# EAGLE schematic ro (EAGLE 6.1)

## Sheet 1 of 4: MC Microcontroller
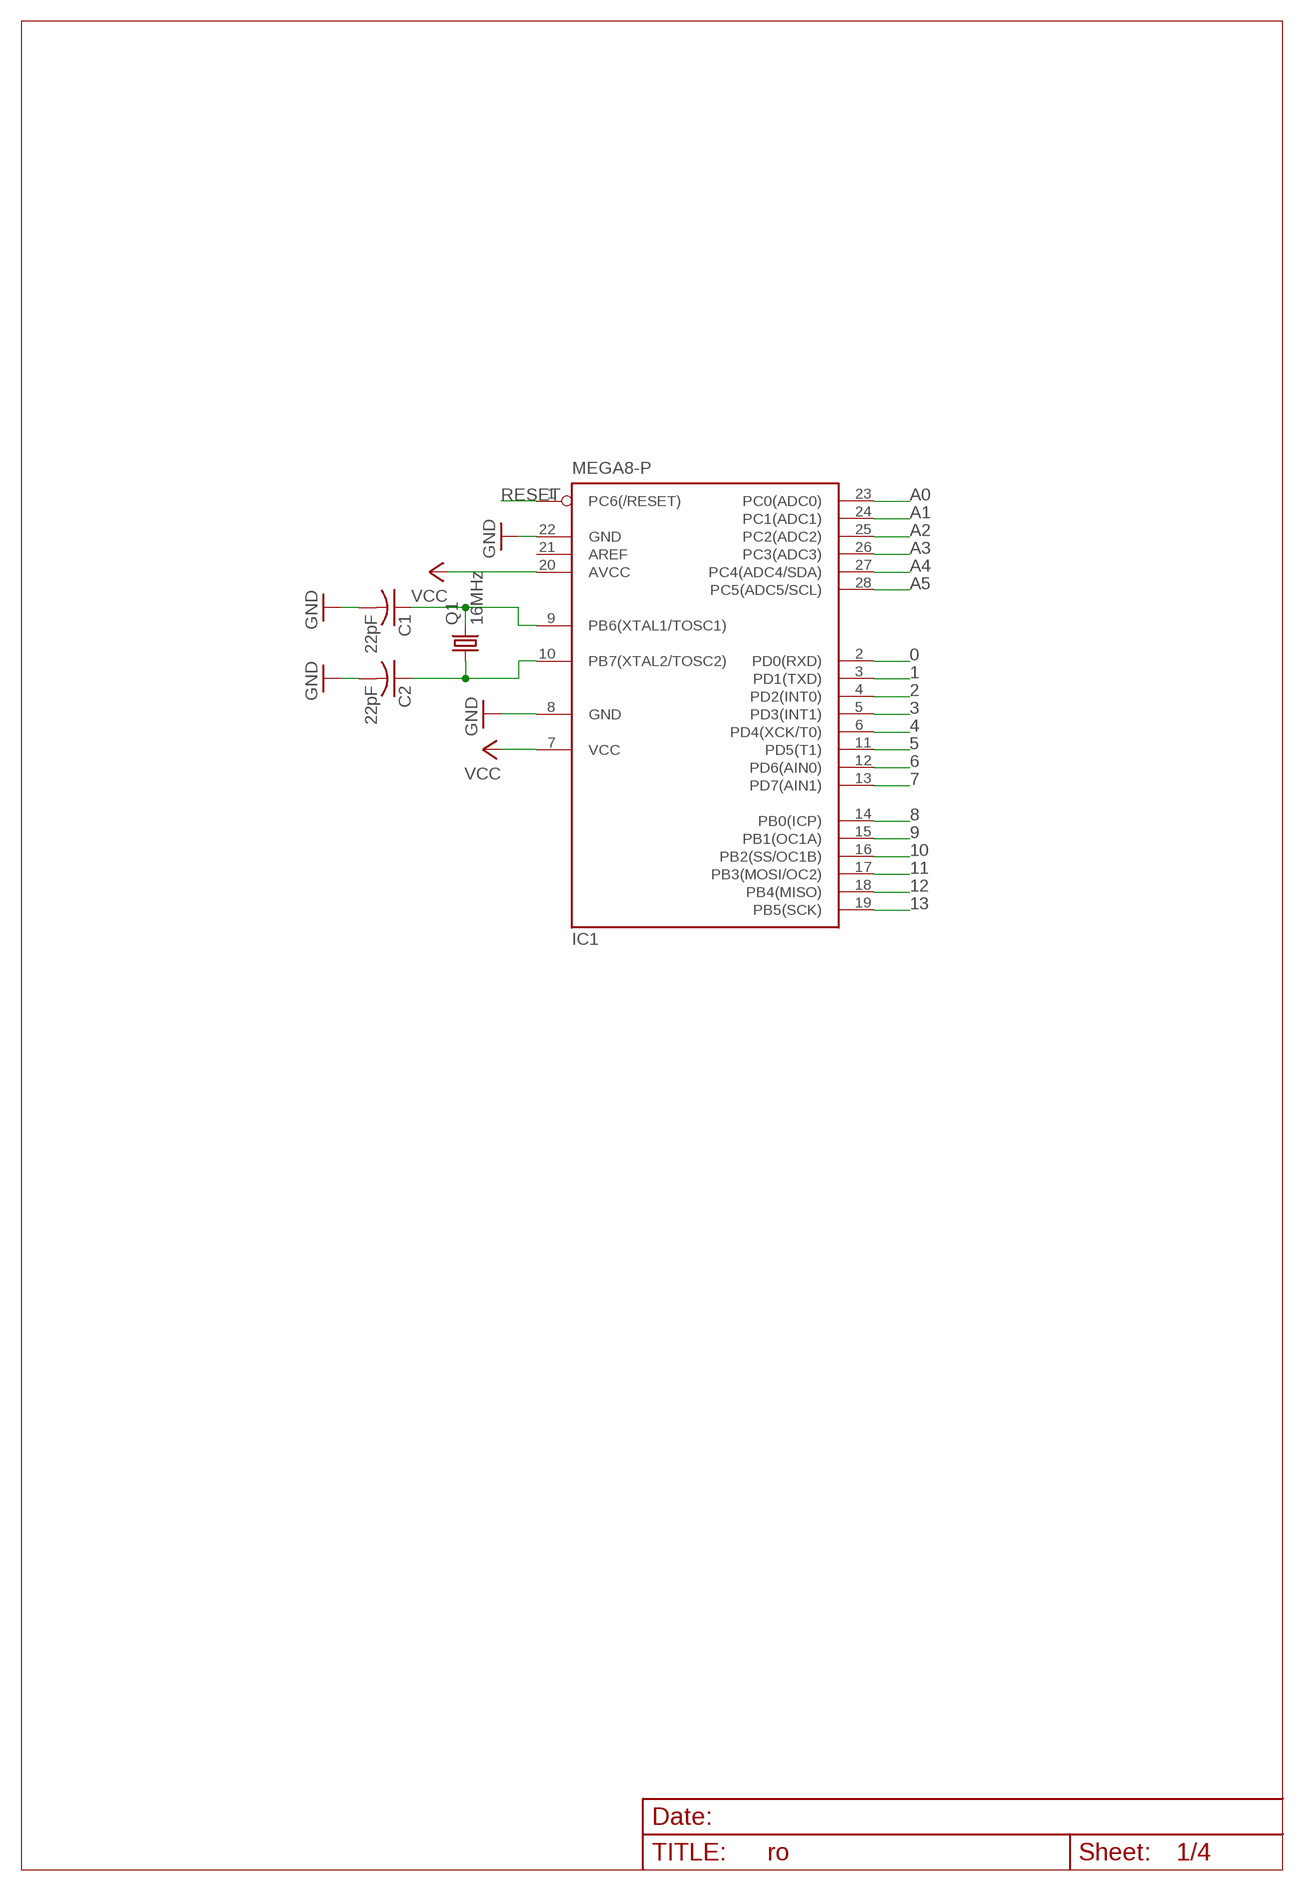
[diagram p0: schematic, sheet 1]

### Parts
C1  22pF  C-US025-025X050  [C025-025X050]
C2  22pF  C-US025-025X050  [C025-025X050]
IC1  MEGA8-P  [DIL28-3]
Q1  16MHz  CRYSTALHC49S  [HC49/S]

### Nets
0: IC1.2(PD0(RXD))
1: IC1.3(PD1(TXD))
2: IC1.4(PD2(INT0)) ; also sheet 3
3: IC1.5(PD3(INT1)) ; also sheet 3
4: IC1.6(PD4(XCK/T0))
5: IC1.11(PD5(T1))
6: IC1.12(PD6(AIN0))
7: IC1.13(PD7(AIN1)) ; also sheet 4
8: IC1.14(PB0(ICP)) ; also sheet 4
9: IC1.15(PB1(OC1A)) ; also sheet 4
10: IC1.16(PB2(SS/OC1B)) ; also sheet 4
11: IC1.17(PB3(MOSI/OC2)) ; also sheet 4
12: IC1.18(PB4(MISO)) ; also sheet 4
13: IC1.19(PB5(SCK))
A0: IC1.23(PC0(ADC0))
A1: IC1.24(PC1(ADC1))
A2: IC1.25(PC2(ADC2))
A3: IC1.26(PC3(ADC3)) ; also sheet 2
A4: IC1.27(PC4(ADC4/SDA)) ; also sheet 2
A5: IC1.28(PC5(ADC5/SCL)) ; also sheet 2
GND: C1.2 C2.2 IC1.8(GND) IC1.22(GND) ; also sheet 2,3,4
N$1: C1.1 IC1.9(PB6(XTAL1/TOSC1)) Q1.2
N$2: C2.1 IC1.10(PB7(XTAL2/TOSC2)) Q1.1
RESET: IC1.1(PC6(/RESET)) ; also sheet 3
VCC: IC1.7(VCC) IC1.20(AVCC) ; also sheet 2,3,4
Unconnected: IC1.21(AREF)

## Sheet 2 of 4: MAX6675 Thermocouple
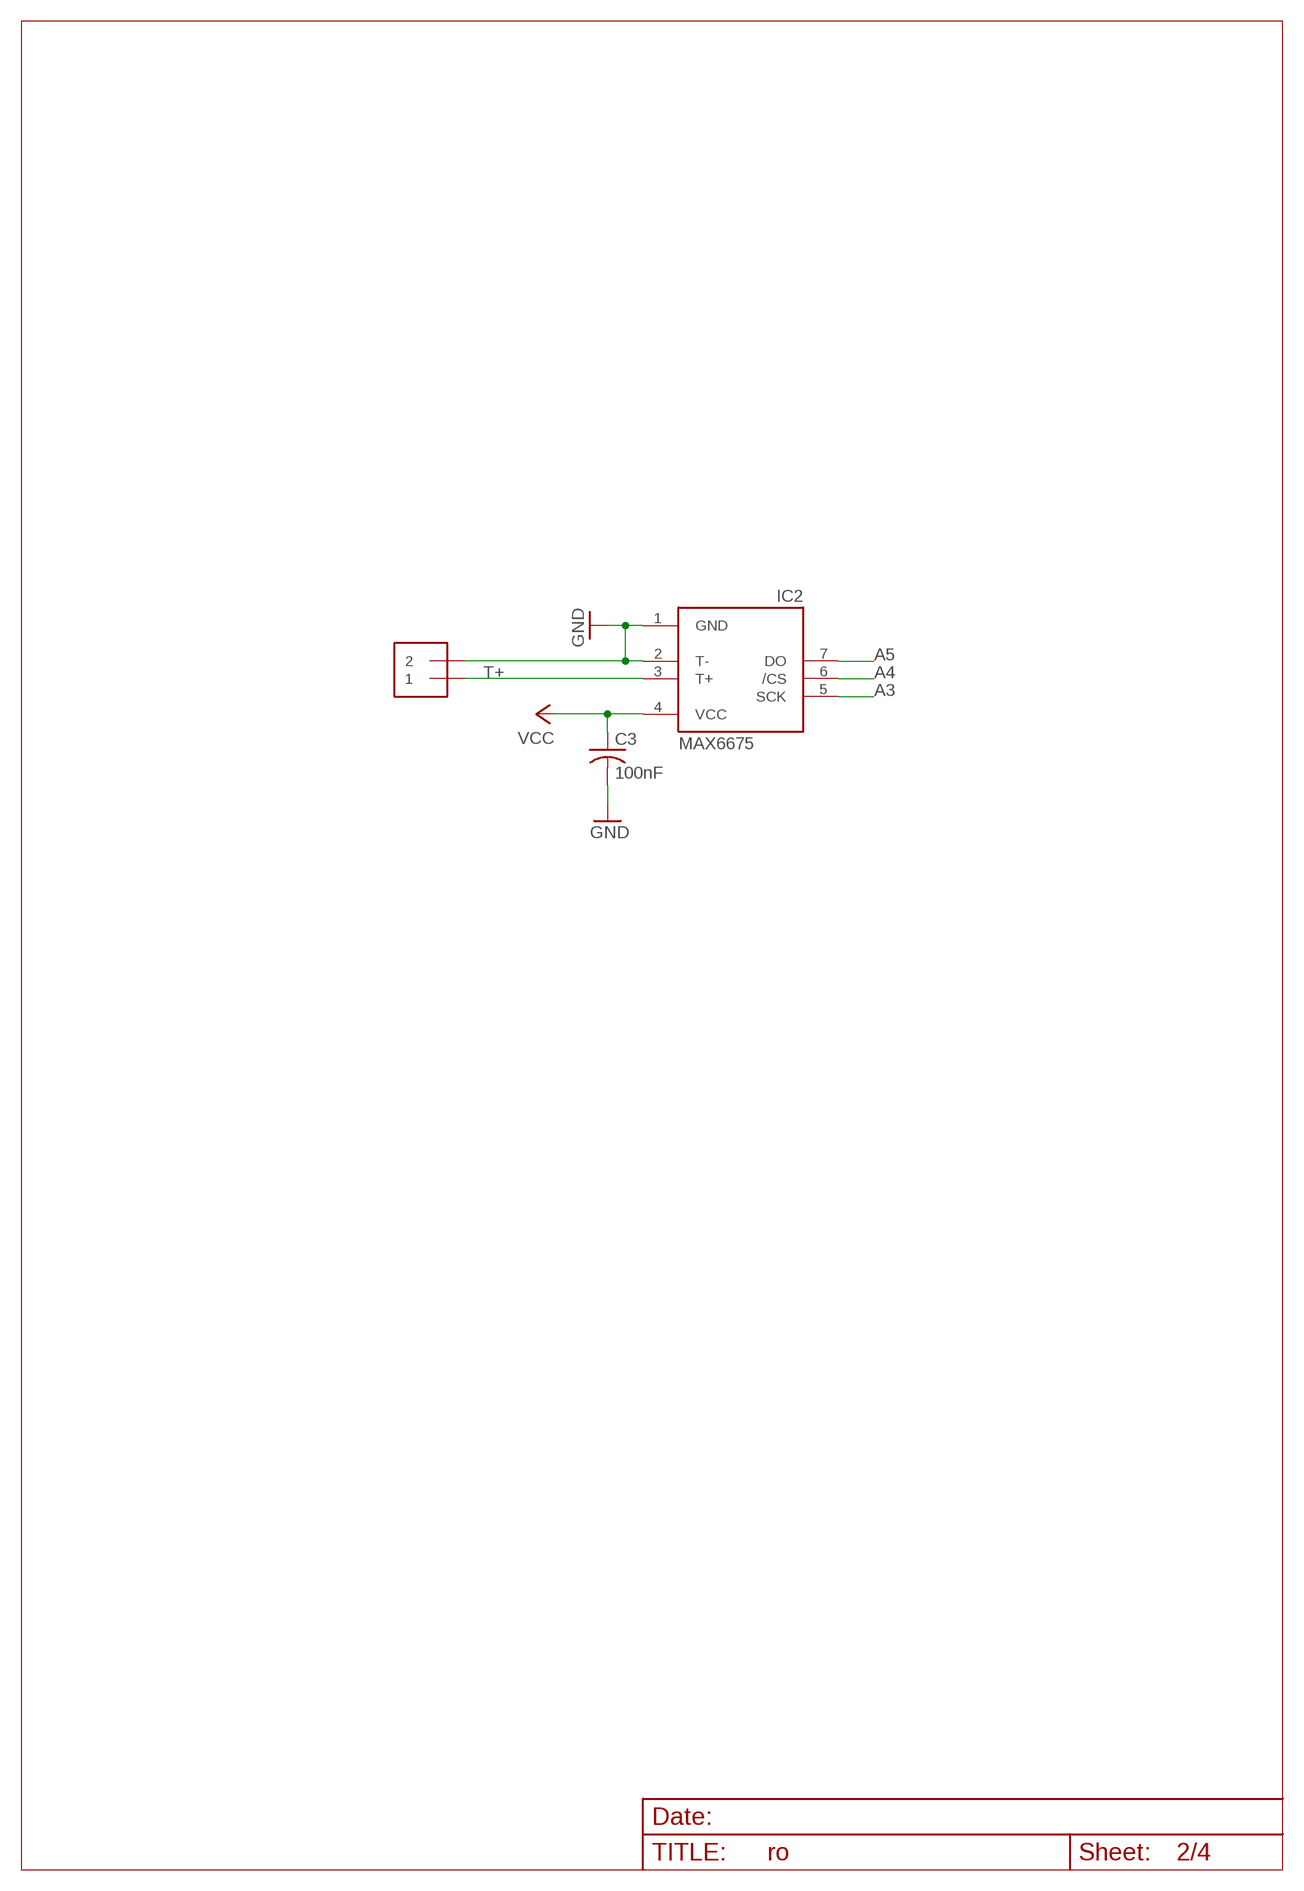
[diagram p1: schematic, sheet 2]

### Parts
C3  100nF  C-US025-025X050  [C025-025X050]
IC2  MAX6675  [SO08]
TC  1X2-3.5MM  [1X2-3.5MM]

### Nets
A3: IC2.5(SCK) ; also sheet 1
A4: IC2.6(/CS) ; also sheet 1
A5: IC2.7(DO) ; also sheet 1
GND: C3.2 IC2.1(GND) IC2.2(T-) TC.2 ; also sheet 1,3,4
T+: IC2.3(T+) TC.1
VCC: C3.1 IC2.4(VCC) ; also sheet 1,3,4

## Sheet 3 of 4: buttons hardware debounce
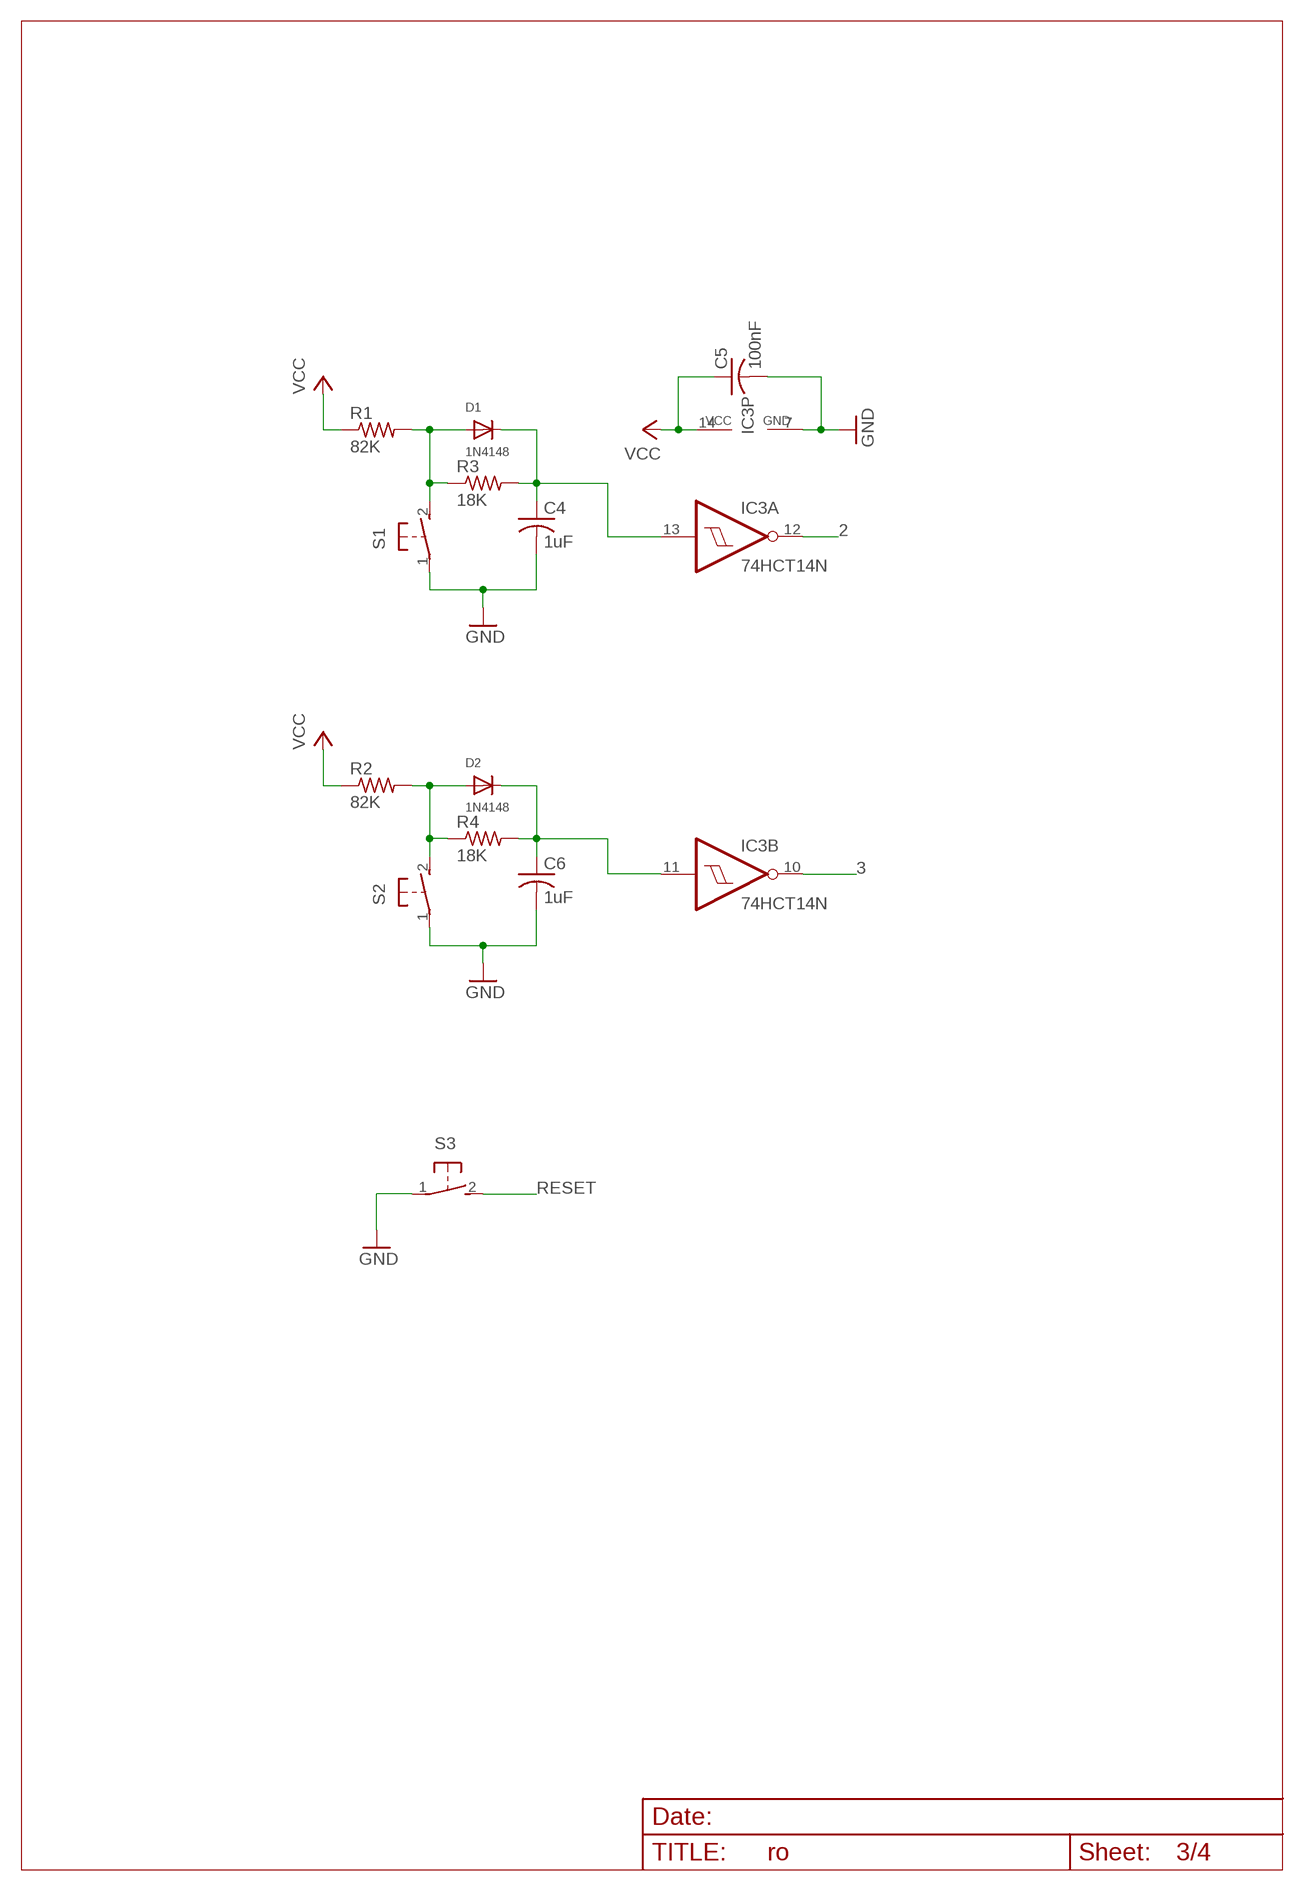
[diagram p2: schematic, sheet 3]

### Parts
C4  1uF  C-USC0805  [C0805]
C5  100nF  C-USC0805  [C0805]
C6  1uF  C-USC0805  [C0805]
D1  1N4148  DIODESMA  [SMADIODE]
D2  1N4148  DIODESMA  [SMADIODE]
IC3  74HCT14N  [DIL14]
R1  82K  R-US_R0805  [R0805]
R2  82K  R-US_R0805  [R0805]
R3  18K  R-US_R0805  [R0805]
R4  18K  R-US_R0805  [R0805]
S1  31-XX  [B3F-31XX]
S2  31-XX  [B3F-31XX]
S3  31-XX  [B3F-31XX]

### Nets
2: IC3.12(A:O) ; also sheet 1
3: IC3.10(B:O) ; also sheet 1
GND: C4.2 C5.2 C6.2 IC3.7(P:GND) S1.1(P) S2.1(P) S3.1(P) ; also sheet 1,2,4
N$3: D1.A R1.2 R3.1 S1.2(S)
N$4: D2.A R2.2 R4.1 S2.2(S)
N$5: C4.1 D1.C IC3.13(A:I) R3.2
N$6: C6.1 D2.C IC3.11(B:I) R4.2
RESET: S3.2(S) ; also sheet 1
VCC: C5.1 IC3.14(P:VCC) R1.1 R2.1 ; also sheet 1,2,4
Unconnected: IC3.1(D:I) IC3.2(D:O) IC3.3(E:I) IC3.4(E:O) IC3.5(F:I) IC3.6(F:O) IC3.8(C:O) IC3.9(C:I)

## Sheet 4 of 4
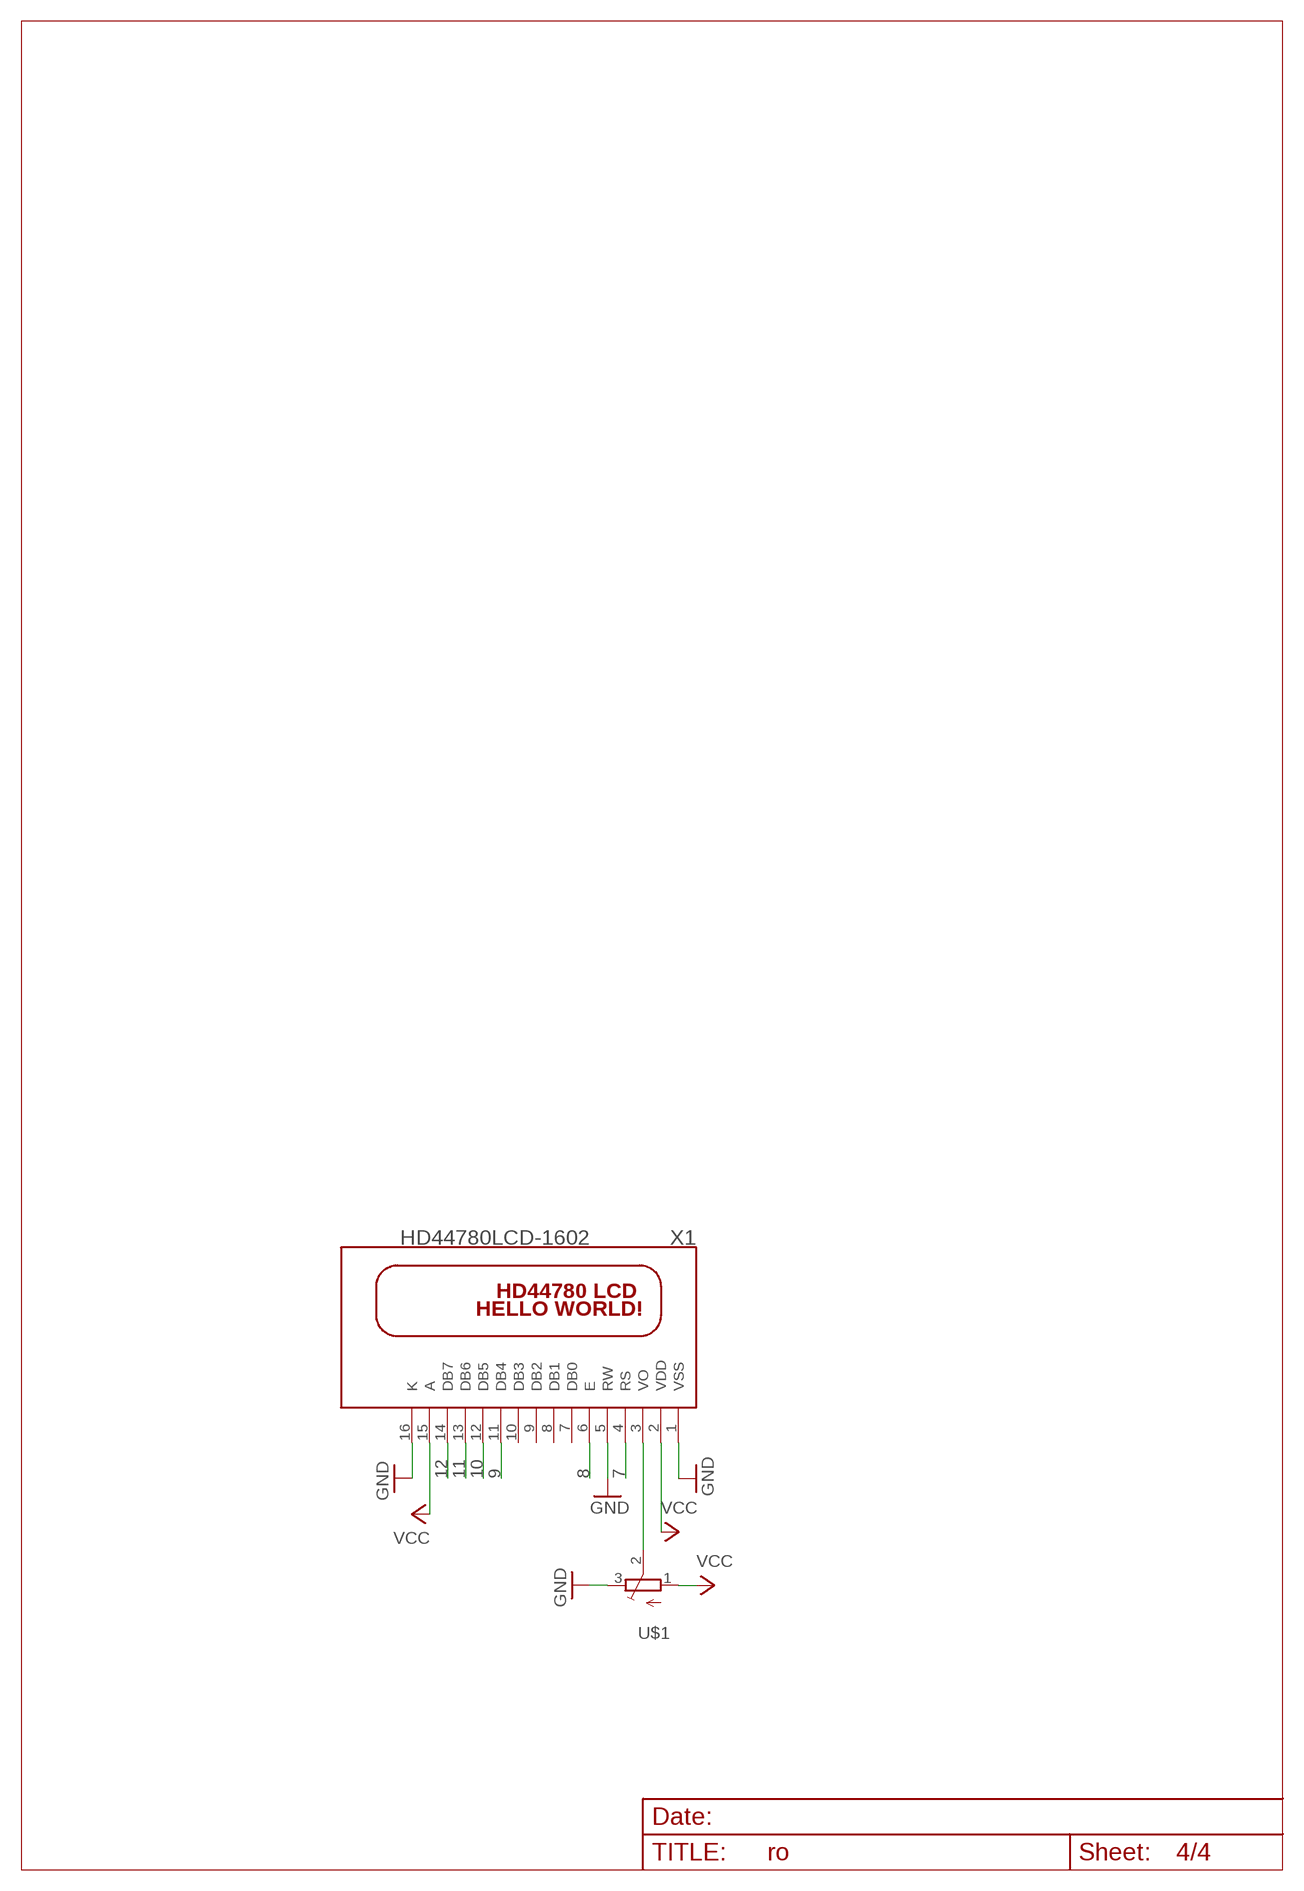
[diagram p3: schematic, sheet 4]

### Parts
U$1  TRIMPOTTC33X  [TC33X]
X1  HD44780LCD-1602  [LCD1602]

### Nets
7: X1.4(RS) ; also sheet 1
8: X1.6(E) ; also sheet 1
9: X1.11(DB4) ; also sheet 1
10: X1.12(DB5) ; also sheet 1
11: X1.13(DB6) ; also sheet 1
12: X1.14(DB7) ; also sheet 1
GND: U$1.3(E) X1.1(VSS) X1.5(RW) X1.16(K) ; also sheet 1,2,3
N$11: U$1.2(S) X1.3(VO)
VCC: U$1.1(A) X1.2(VDD) X1.15(A) ; also sheet 1,2,3
Unconnected: X1.7(DB0) X1.8(DB1) X1.9(DB2) X1.10(DB3)

## Library data of the parts
C1-C6 = resistor:C-US: CAPACITOR, American symbol
D1 D2 = adafruit:DIODE: Diode SMADIODE - SMA Surface Mount Package 20V 1A Schottky Diode Digikey: 641-1014-6-ND DO-1N4148 - Through Hole Small Current Diode SOD-123 20V 1 A (.5mV Vf) Schottky Diode - Digikey: MBRX120TPMSCT-ND SOD-323 10V 570mA (.38mV Vf, 3ns) Schottky Diode - Digikey: ZLLS410CT-ND SOD-523 30V 30mA Schottky Diode (RB751S-40TE61) - Digikey: RB751S-40TE61CT-ND SOT23-R/W - SOT23 Package (R = Solder Paste/Reflow Ovens, W = Hand-Soldering) BAT54Film 40V 300mA - Digikey: 497-7162-1-ND
IC1 = atmel:MEGA8-P: MICROCONTROLLER 8 Kbytes FLASH, 1 kbytes SRAM, 512 bytes EEPROM, USART, 4-channel 10 bit ADC, 2-channel 8 bit ADC Pin compatible with Atmega48, ATMega88, ATMega168 Source: avr.lbr; OC_FARNELL: unknown; OC_NEWARK: unknown
IC2 = adafruit:MAX6675
IC3 = 74xx-eu:74*14: Hex schmitt trigger INVERTER
Q1 = crystal:CRYSTAL: CRYSTAL; OC_FARNELL: 1667008; OC_NEWARK: unknown
R1-R4 = resistor:R-US_: RESISTOR, American symbol
S1-S3 = adafruit:31-XX: OMRON SWITCH Now with beefier pads!
TC = adafruit:1X2: 3.5mm Terminal block http://www.ladyada.net/library/pcb/eaglelibrary.html
U$1 = adafruit:TRIMPOT: SMT trimmer potentiometer part number TC33X http://www.ladyada.net/library/eagle
X1 = adafruit:HD44780LCD: HD44780 LCD Standard character type LCDs, available in sizes from 8x1 to 40x4!